# Altium schematic sheet 混频器.SchDoc
size A4
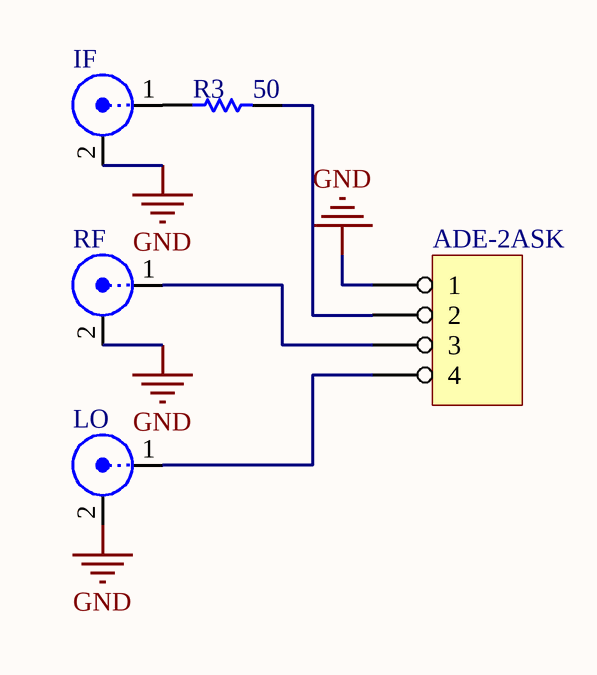
[diagram p0: 混频器.SchDoc]

## Parts
ADE-2ASK  4 HEADER  [PL-052]  (value not drawn)
IF  SMA-2  [SMA-2]  (value not drawn)
LO  SMA-2  [SMA-2]  (value not drawn)
R3  值: 50  [0805]  (hidden comment: RES)
RF  SMA-2  [SMA-2]  (value not drawn)

## Nets
GND: ADE-2ASK.1 IF.2(GND) LO.2(GND) RF.2(GND)
NetADE-2ASK_2: ADE-2ASK.2 R3.2
NetADE-2ASK_3: ADE-2ASK.3 RF.1(Signal)
NetADE-2ASK_4: ADE-2ASK.4 LO.1(Signal)
NetIF_1: IF.1(Signal) R3.1

## Library data of the parts
ADE-2ASK = 4 HEADER: 4 Pin Header